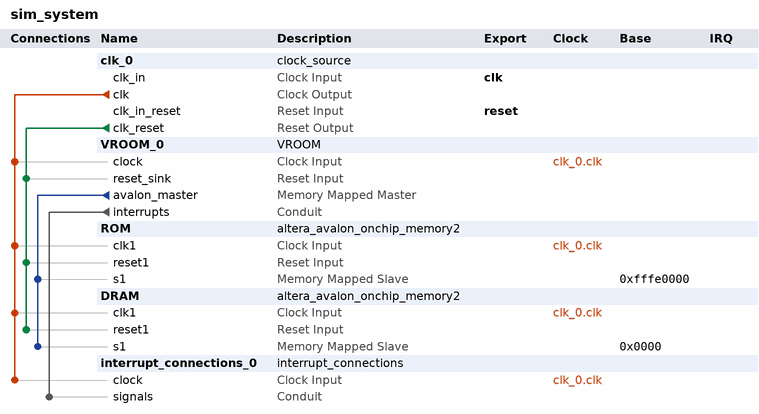
[diagram p0: system contents]
# Platform Designer (Qsys) system sim_system, Stratix V 5SGSMD5K1F40C1
# Parameters at their usual value, and those the tool derives, are not listed.
package require -exact qsys 23.1
create_system sim_system
set_project_property DEVICE_FAMILY {Stratix V}
set_project_property DEVICE 5SGSMD5K1F40C1

add_instance clk_0 clock_source 23.1
set_instance_parameter_value clk_0 clockFrequency 50000000

add_instance VROOM_0 VROOM 1.0
set_instance_parameter_value VROOM_0 SIMULATION false

add_instance ROM altera_avalon_onchip_memory2 23.1
set_instance_parameter_value ROM dataWidth 32
set_instance_parameter_value ROM dualPort false
set_instance_parameter_value ROM initMemContent true
set_instance_parameter_value ROM initializationFileName /home/julien/work/VROOM/fpga/proj/storeypeak/rom.mif
set_instance_parameter_value ROM memorySize 131072
set_instance_parameter_value ROM useNonDefaultInitFile true
set_instance_parameter_value ROM writable false

add_instance DRAM altera_avalon_onchip_memory2 23.1
set_instance_parameter_value DRAM dataWidth 32
set_instance_parameter_value DRAM dualPort false
set_instance_parameter_value DRAM initMemContent true
set_instance_parameter_value DRAM initializationFileName onchip_mem.hex
set_instance_parameter_value DRAM memorySize 32768

add_instance interrupt_connections_0 interrupt_connections 1.0

# connections
add_connection clk_0.clk DRAM.clk1 clock
add_connection clk_0.clk interrupt_connections_0.clock clock
add_connection clk_0.clk ROM.clk1 clock
add_connection clk_0.clk VROOM_0.clock clock
add_connection clk_0.clk_reset DRAM.reset1 reset
add_connection clk_0.clk_reset ROM.reset1 reset
add_connection clk_0.clk_reset VROOM_0.reset_sink reset
add_connection VROOM_0.avalon_master DRAM.s1 avalon
set_connection_parameter_value VROOM_0.avalon_master/DRAM.s1 baseAddress 0x0000
add_connection VROOM_0.avalon_master ROM.s1 avalon
set_connection_parameter_value VROOM_0.avalon_master/ROM.s1 baseAddress 0xfffe0000
add_connection VROOM_0.interrupts interrupt_connections_0.signals conduit

# exported interfaces
add_interface clk clock sink
set_interface_property clk EXPORT_OF clk_0.clk_in
add_interface reset reset sink
set_interface_property reset EXPORT_OF clk_0.clk_in_reset

set_interconnect_requirement {$system} qsys_mm.clockCrossingAdapter HANDSHAKE
set_interconnect_requirement {$system} qsys_mm.enableEccProtection FALSE
set_interconnect_requirement {$system} qsys_mm.insertDefaultSlave FALSE
set_interconnect_requirement {$system} qsys_mm.maxAdditionalLatency 1

save_system sim_system.qsys
